# EAGLE design BMS (EAGLE 9.5.1)
ESKD_DESCRIPTION1: 207|235|224|242|224|32|192|193; ESKD_DESCRIPTION2: 241|245|229|236|224|32|253|235|229|234|242|240|232|247|229|241|234|224|255; ESKD_DESCRIPTION3: 239|240|232|237|246|232|239|232|224|235|252|237|224|255; ESKD_NUMBER: 67|67|83|49|46|51|50|48|48|45|48|221|51; ESKD_NUMBER_SHEET: 49; ESKD_SHEETS: 49
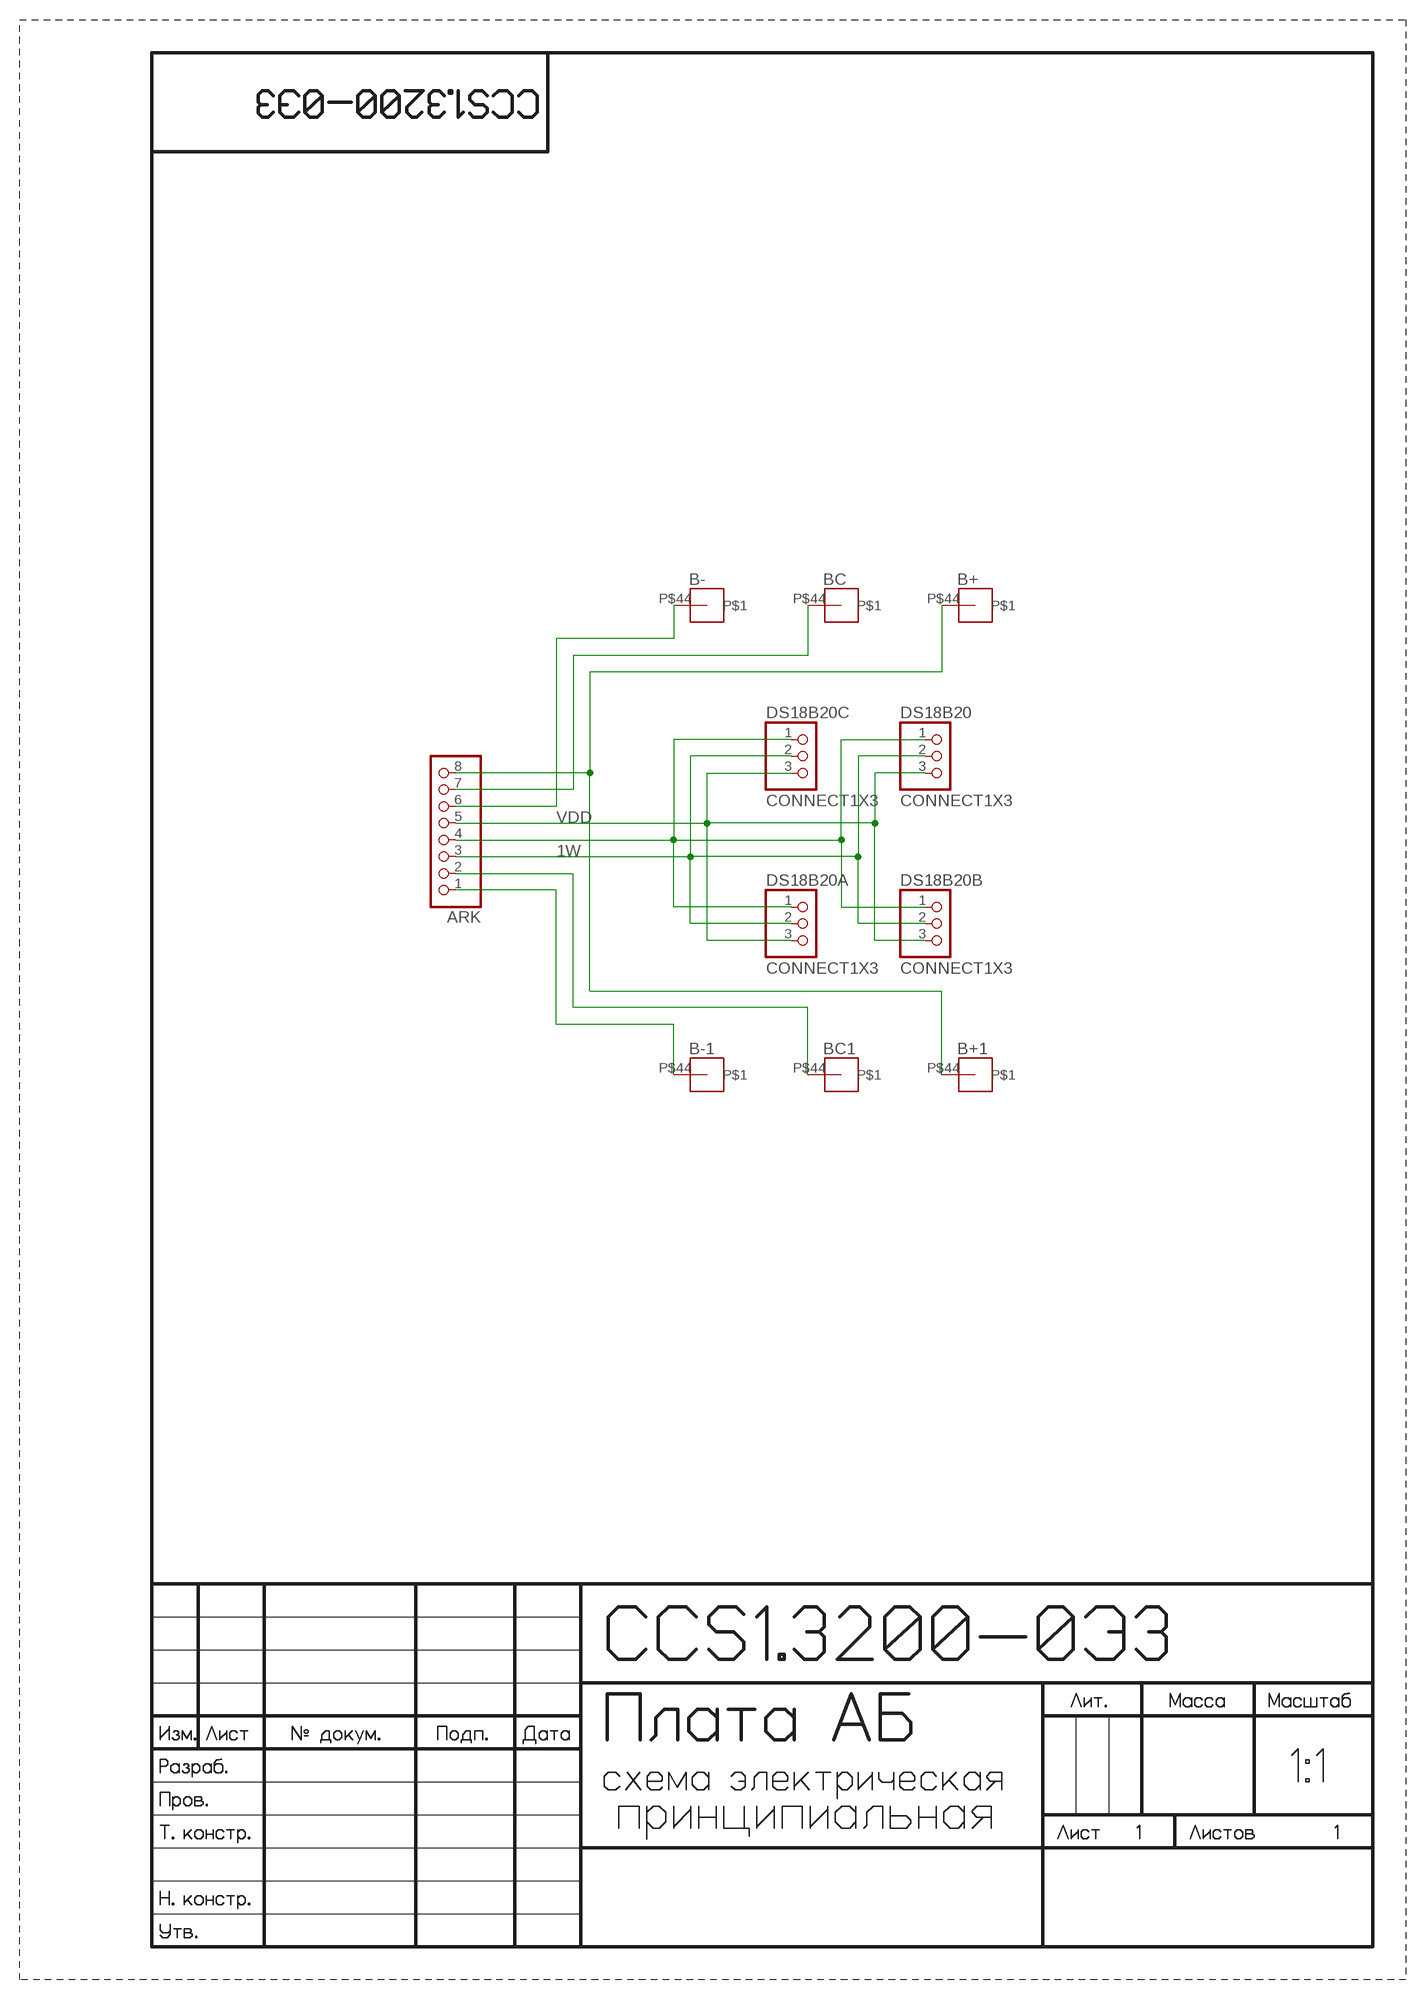
[diagram p0: schematic, sheet 1]

## Parts
ARK  PINHD-1X8  [1X08]
B+  DRILLBAT5  [DRILLBAT5]
B+1  DRILLBAT5  [DRILLBAT5]
B-  DRILLBAT5  [DRILLBAT5]
B-1  DRILLBAT5  [DRILLBAT5]
BC  DRILLBAT5  [DRILLBAT5]
BC1  DRILLBAT5  [DRILLBAT5]
DS18B20  CONNECT1X3  [CONNECT1X3]
DS18B20A  CONNECT1X3  [CONNECT1X3]
DS18B20B  CONNECT1X3  [CONNECT1X3]
DS18B20C  CONNECT1X3  [CONNECT1X3]

## Nets
1W: ARK.3 DS18B20.2 DS18B20A.2 DS18B20B.2 DS18B20C.2
BMS+: ARK.8 B+1.P$44 B+.P$44
N$1: ARK.4 DS18B20.1 DS18B20A.1 DS18B20B.1 DS18B20C.1
N$2: ARK.6 B-.P$44
N$3: ARK.1 B-1.P$44
N$205: ARK.7 BC.P$44
N$206: ARK.2 BC1.P$44
VDD: ARK.5 DS18B20.3 DS18B20A.3 DS18B20B.3 DS18B20C.3

## Library data of the parts
ARK = pinheadCS:PINHD-1X8: PIN HEADER
B+ B+1 B- B-1 BC BC1 = CanCubeSat:DRILLBAT5
DS18B20 DS18B20A DS18B20B DS18B20C = CanCubeSat:CONNECT1X3

## Board
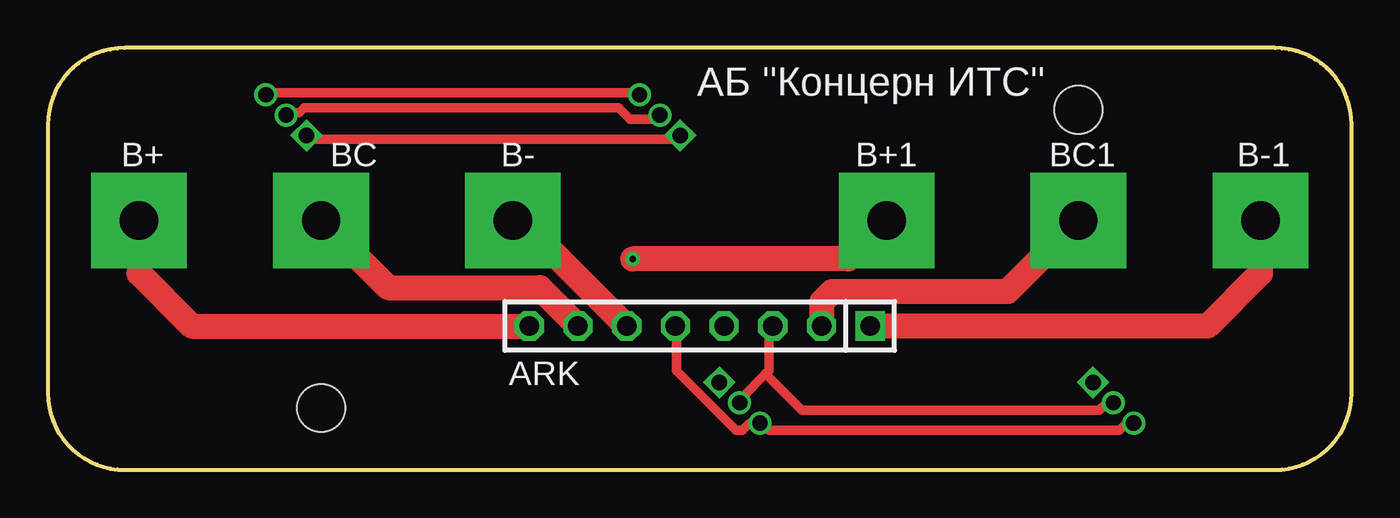
[diagram p1: board, top side]
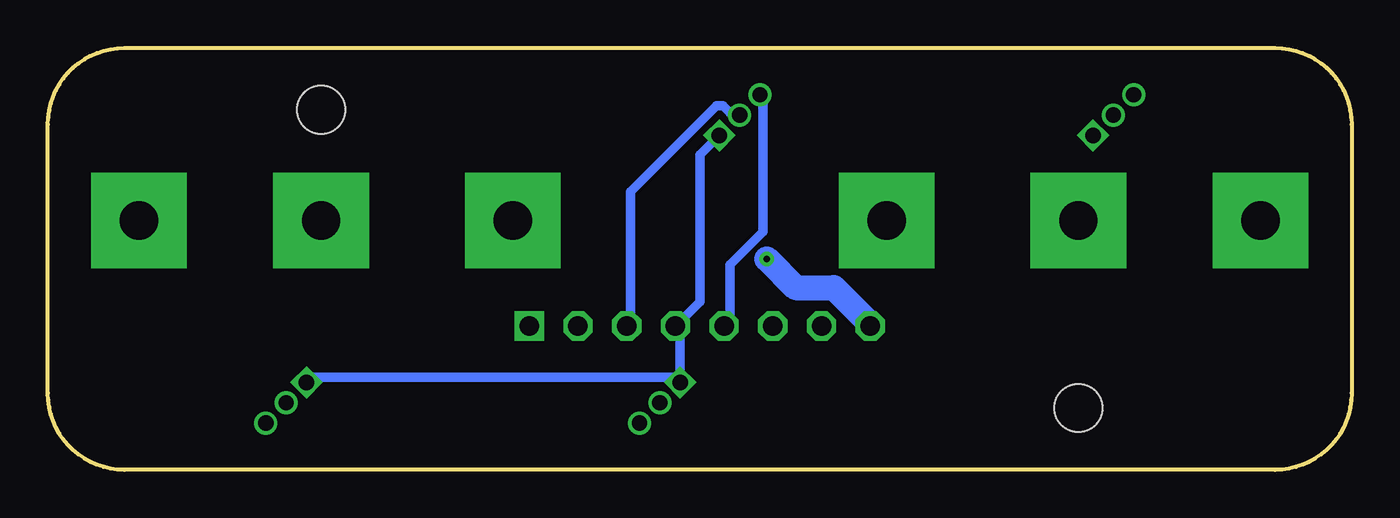
[diagram p2: board, bottom side, seen from below]

Size 68 x 22 mm. Coordinates in mm from the lower left corner, seen from the top.
Outline: 68,4 68,18 arc90 64,22 4,22 arc90 0,18 0,4 arc90 4,0 64,0 arc90 68,4
Copper layers (1*16): Top 0.035mm / dielectric 1.5mm / Bottom 0.035mm
Design rules "default *": minimum track width 0.5mm, minimum drill 0.35mm, track to track 0.22mm, track to pad 0.22mm, pad to pad 0.22mm, via to via 0.22mm, smd to smd 0.22mm, copper to edge 30mil, drill to drill 8mil, minimum pad ring 6mil, minimum via ring 8mil, stop-mask expansion 4mil, vias tented up to drill 0mil, thermal gap 10mil
Holes 2.5 mm at 14.25,3.23 53.75,18.77

### Footprints (pad centres in the part's own frame; a part is rotated, then mirrored left to right if it is on the bottom)
1X08 = drill 1.016 square: 1 -8.89,0 | drill 1.016 octagon: 2 -6.35,0; 3 -3.81,0; 4 -1.27,0; 5 1.27,0; 6 3.81,0; 7 6.35,0; 8 8.89,0
DRILLBAT5 = drill 2 pad 5 square: P$44 0,0
CONNECT1X3 = drill 0.8 pad 1.2 square: 1 -1.5,0 | drill 0.8 pad 1.2: 2 0,0; 3 1.5,0

### Placement (x,y rotation side)
ARK  34,7.5 180 top
B+  4.75,13 0 top
B+1  43.75,13 0 top
B-  24.25,13 0 top
B-1  63.25,13 0 top
BC  14.25,13 0 top
BC1  53.75,13 0 top
DS18B20  31.92,18.5 135 top
DS18B20A  36.08,3.5 315 top
DS18B20B  12.42,18.5 135 top
DS18B20C  55.58,3.5 315 top

### Tracks (layer width: path | path; a pad name or v marks a point on that pad's centre or on a via)
1W
  Top 0.5: DS18B20B.2 12.77,18.63 13.11,18.63 13.36,18.88 29.77,18.88 30.36,18.29 31.74,18.29 DS18B20.2 | 37.43,5 37.6,5.17 37.6,7.25 ARK.3 | 37.43,5 36.23,3.79 DS18B20A.2 | 37.43,5 39.33,3.1 54.85,3.1 55.2,3.45 55.55,3.45 DS18B20C.2
  Bottom 0.5: DS18B20.2 32.09,18.63 32.43,18.63 32.77,18.98 33.12,18.98 37.6,14.49 37.6,7.59 ARK.3
BMS+  (via drill 0.35)
  Top 1.3: B+.P$44 4.75,10.25 7.5,7.5 ARK.8 | B+1.P$44 41.75,11 v30.5,11
  Bottom 1.3: v30.5,11 29,9.5 27,9.5 25.11,7.61 ARK.8
N$1
  Top 0.5: DS18B20B.1 13.8,17.25 32.77,17.25 DS18B20.1
  Bottom 0.5: DS18B20.1 34,16.42 34,8.77 ARK.4 35.02,7.25 DS18B20A.1 35.19,4.83 54.51,4.83 DS18B20C.1
N$2
  Top 1.3: B-.P$44 24.69,13 ARK.6
N$3
  Top 1.3: B-1.P$44 63.25,10.25 60.5,7.5 ARK.1
N$205
  Top 1.3: BC.P$44 17.75,9.5 25.65,9.5 ARK.7
N$206
  Top 1.3: BC1.P$44 50.05,9.3 40.9,9.3 40.35,8.75 ARK.2
VDD
  Top 0.5: DS18B20B.3 11.38,19.66 30.7,19.66 DS18B20.3 | ARK.5 32.77,7.25 32.77,5.17 35.88,2.07 36.23,2.07 36.57,2.42 36.91,2.42 DS18B20A.3 37.26,2.42 37.6,2.07 55.89,2.07 56.23,2.42 56.58,2.42 DS18B20C.3
  Bottom 0.5: DS18B20.3 30.7,19.32 30.7,12.42 32.43,10.7 32.43,7.59 ARK.5

### Text on the board
tNames: АБ "Концерн ИТС"